# Altium schematic sheet Input Filtering.SchDoc
size A4
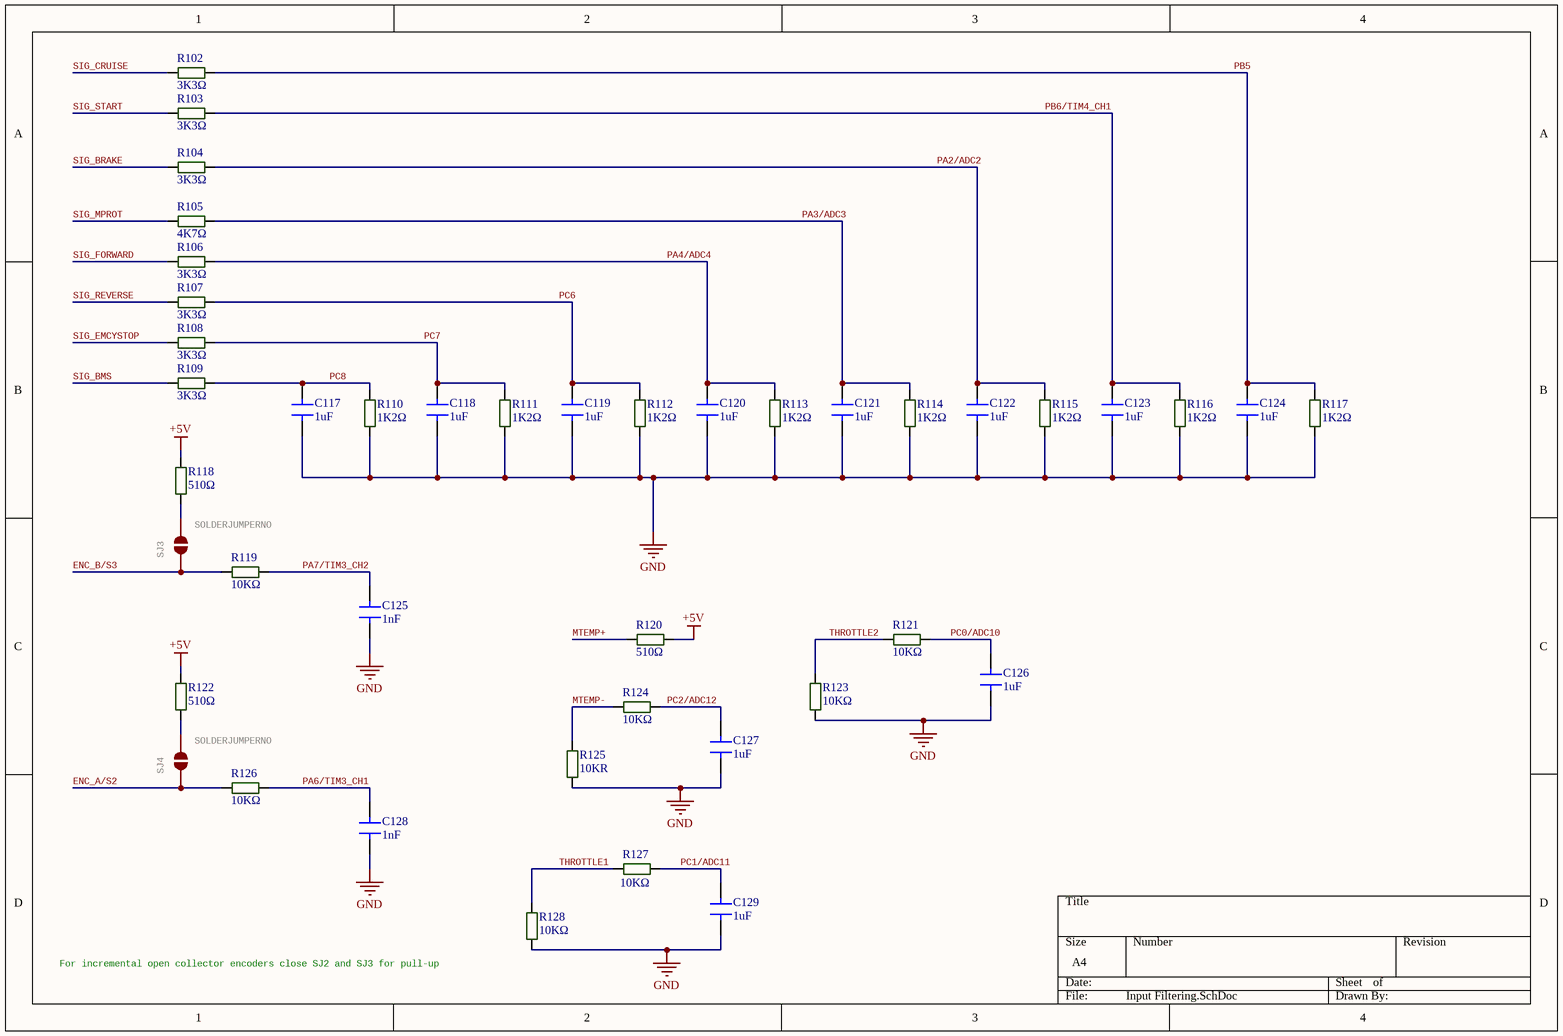
[diagram p0: Input Filtering.SchDoc]

## Parts
C117  1uF  [C-0603W]
C118  1uF  [C-0603W]
C119  1uF  [C-0603W]
C120  1uF  [C-0603W]
C121  1uF  [C-0603W]
C122  1uF  [C-0603W]
C123  1uF  [C-0603W]
C124  1uF  [C-0603W]
C125  1nF  [C-0603W]
C126  1uF  [C-0603W]
C127  1uF  [C-0603W]
C128  1nF  [C-0603W]
C129  1uF  [C-0603W]
R102  3K3Ω  [R-0603R]
R103  3K3Ω  [R-0603R]
R104  3K3Ω  [R-0603R]
R105  4K7Ω  [R-0603R]
R106  3K3Ω  [R-0603R]
R107  3K3Ω  [R-0603R]
R108  3K3Ω  [R-0603R]
R109  3K3Ω  [R-0603R]
R110  1K2Ω  [R-0603R]
R111  1K2Ω  [R-0603R]
R112  1K2Ω  [R-0603R]
R113  1K2Ω  [R-0603R]
R114  1K2Ω  [R-0603R]
R115  1K2Ω  [R-0603R]
R116  1K2Ω  [R-0603R]
R117  1K2Ω  [R-0603R]
R118  510Ω  [R-0603R]
R119  10KΩ  [R-0603R]
R120  510Ω  [R-0603R]
R121  10KΩ  [R-0603R]
R122  510Ω  [R-0603R]
R123  10KΩ  [R-0603R]
R124  10KΩ  [R-0603R]
R125  10KR  [R-0603R]
R126  10KΩ  [R-0603R]
R127  10KΩ  [R-0603R]
R128  10KΩ  [R-0603R]
SJ3  SOLDERJUMPERNO  [SJ_2S-NO]
SJ4  SOLDERJUMPERNO  [SJ_2S-NO]

## Nets
+5V: R118.2 R120.2 R122.2
GND: C117.1 C118.1 C119.1 C120.1 C121.1 C122.1 C123.1 C124.1 C125.1 C126.1 C127.1 C128.1 C129.1 R110.1 R111.1 R112.1 R113.1 R114.1 R115.1 R116.1 R117.1 R123.1 R125.1 R128.1
ENC_A/S2: R126.1 SJ4.1
ENC_B/S3: R119.1 SJ3.1
MTEMP+: R120.1
MTEMP-: R124.1 R125.2
PA2/ADC2: C122.2 R104.2 R115.2
PA3/ADC3: C121.2 R105.2 R114.2
PA4/ADC4: C120.2 R106.2 R113.2
PA6/TIM3_CH1: C128.2 R126.2
PA7/TIM3_CH2: C125.2 R119.2
PB5: C124.2 R102.2 R117.2
PB6/TIM4_CH1: C123.2 R103.2 R116.2
PC0/ADC10: C126.2 R121.2
PC1/ADC11: C129.2 R127.2
PC2/ADC12: C127.2 R124.2
PC6: C119.2 R107.2 R112.2
PC7: C118.2 R108.2 R111.2
PC8: C117.2 R109.2 R110.2
SIG_BMS: R109.1
SIG_BRAKE: R104.1
SIG_CRUISE: R102.1
SIG_EMCYSTOP: R108.1
SIG_FORWARD: R106.1
SIG_MPROT: R105.1
SIG_REVERSE: R107.1
SIG_START: R103.1
THROTTLE1: R127.1 R128.2
THROTTLE2: R121.1 R123.2
NetR118_1: R118.1 SJ3.2
NetR122_1: R122.1 SJ4.2

## Notes on the sheet
- For incremental open collector encoders close SJ2 and SJ3 for pull-up

## Library data of the parts
C117-C129 = C-0603
R102-R128 = R-0603
SJ3 SJ4 = SOLDERJUMPERNO: Solder JumperStandard SMD solder jumper. Used to automate production. Two varients : Normally Open and Normally Closed are the same, but have different paste layers. NC will have a large amount of paste and should jumper during reflow.; GateName_1: 1; SymbolName_1: SJ; DeviceName: NO; LibraryName: SparkFun-Passives; DeviceSetName: SOLDERJUMPER